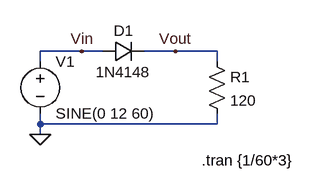
[diagram p0: schematic Plot and Traces.asc]
Plot and Traces.asc, the LTspice schematic file:
Version 4
SHEET 1 880 680
WIRE 128 96 64 96
WIRE 160 96 128 96
WIRE 272 96 224 96
WIRE 336 96 272 96
WIRE 64 112 64 96
WIRE 336 112 336 96
WIRE 64 208 64 192
WIRE 336 208 336 192
WIRE 336 208 64 208
WIRE 64 224 64 208
FLAG 64 224 0
FLAG 272 96 Vout
FLAG 128 96 Vin
SYMBOL voltage 64 96 R0
WINDOW 123 0 0 Left 0
WINDOW 39 0 0 Left 0
SYMATTR InstName V1
SYMATTR Value SINE(0 12 60)
SYMBOL res 320 96 R0
SYMATTR InstName R1
SYMATTR Value 120
SYMBOL diode 160 112 R270
WINDOW 0 32 32 VTop 2
WINDOW 3 0 32 VBottom 2
SYMATTR InstName D1
SYMATTR Value 1N4148
TEXT 312 264 Left 2 !.tran {1/60*3}

The netlist it stands for:
* Plot and Traces.asc
V1 Vin 0 SINE(0 12 60)
R1 Vout 0 120
D1 Vin Vout 1N4148
.model D D
.lib standard.dio
.tran {1/60*3}
.backanno
.end